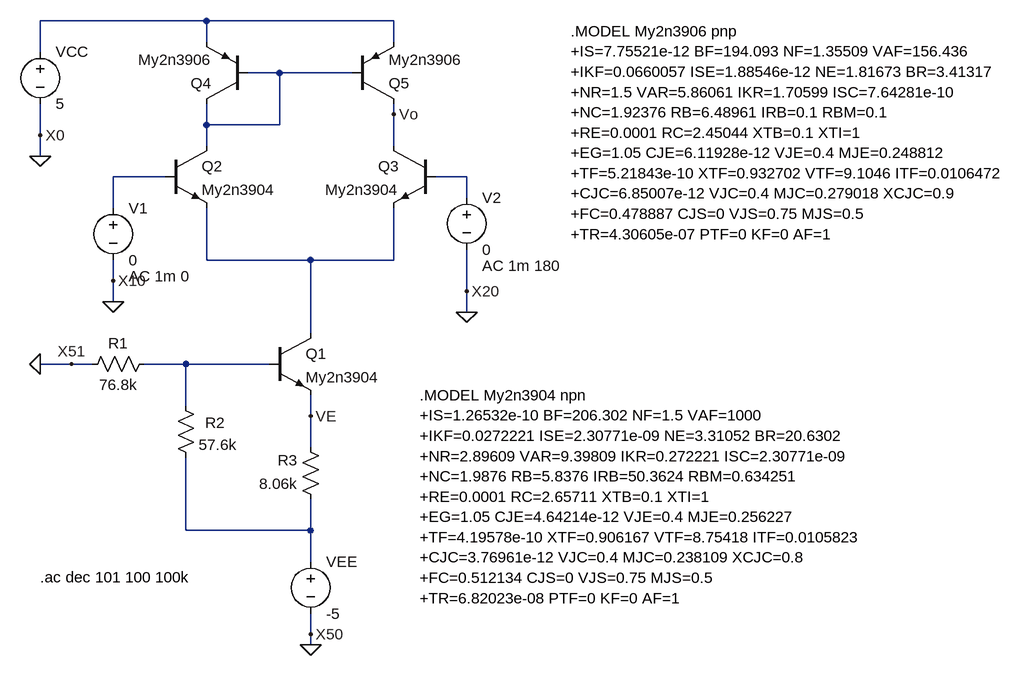
[diagram p0: schematic project3_p3.asc]
project3_p3.asc, the LTspice schematic file:
Version 4
SHEET 1 1432 700
WIRE 128 -384 -128 -384
WIRE 416 -384 128 -384
WIRE 128 -352 128 -384
WIRE 416 -352 416 -384
WIRE -128 -336 -128 -384
WIRE 240 -304 192 -304
WIRE 352 -304 240 -304
WIRE 416 -240 416 -256
WIRE 128 -224 128 -256
WIRE 240 -224 240 -304
WIRE 240 -224 128 -224
WIRE -128 -208 -128 -256
WIRE 128 -192 128 -224
WIRE 416 -192 416 -240
WIRE -128 -176 -128 -208
WIRE 64 -144 -16 -144
WIRE 528 -144 480 -144
WIRE 528 -112 528 -144
WIRE -16 -96 -16 -144
WIRE 128 -16 128 -96
WIRE 288 -16 128 -16
WIRE 416 -16 416 -96
WIRE 416 -16 288 -16
WIRE -16 16 -16 -16
WIRE 528 32 528 -32
WIRE -16 48 -16 16
WIRE 528 64 528 32
WIRE 288 96 288 -16
WIRE -80 144 -128 144
WIRE -48 144 -80 144
WIRE 96 144 32 144
WIRE 224 144 96 144
WIRE 96 208 96 144
WIRE 288 224 288 192
WIRE 288 272 288 224
WIRE 96 400 96 288
WIRE 288 400 288 352
WIRE 288 400 96 400
WIRE 288 448 288 400
WIRE 288 560 288 528
WIRE 288 576 288 560
FLAG -128 144 0
FLAG -128 -176 0
FLAG 288 576 0
FLAG 288 560 X50
FLAG -80 144 X51
FLAG -128 -208 X0
FLAG 288 224 VE
FLAG -16 48 0
FLAG -16 16 X10
FLAG 416 -240 Vo
FLAG 528 64 0
FLAG 528 32 X20
SYMBOL npn 224 96 R0
SYMATTR InstName Q1
SYMATTR Value My2n3904
SYMBOL voltage 288 432 R0
WINDOW 123 0 0 Left 0
WINDOW 39 0 0 Left 0
SYMATTR InstName VEE
SYMATTR Value -5
SYMBOL voltage -128 -352 R0
WINDOW 123 0 0 Left 0
WINDOW 39 0 0 Left 0
SYMATTR InstName VCC
SYMATTR Value 5
SYMBOL res 304 368 R180
WINDOW 0 36 76 Left 2
WINDOW 3 36 40 Left 2
SYMATTR InstName R3
SYMATTR Value 8.06k
SYMBOL res 80 192 R0
WINDOW 0 46 42 Left 2
SYMATTR InstName R2
SYMATTR Value 57.6k
SYMBOL res -64 160 R270
WINDOW 0 32 56 VTop 2
WINDOW 3 0 56 VBottom 2
SYMATTR InstName R1
SYMATTR Value 76.8k
SYMBOL voltage -16 -112 R0
WINDOW 123 24 121 Left 2
WINDOW 39 0 0 Left 0
SYMATTR Value2 AC 1m 0
SYMATTR InstName V1
SYMATTR Value 0
SYMBOL npn 64 -192 R0
SYMATTR InstName Q2
SYMATTR Value My2n3904
SYMBOL npn 480 -192 M0
SYMATTR InstName Q3
SYMATTR Value My2n3904
SYMBOL pnp 192 -256 R180
SYMATTR InstName Q4
SYMATTR Value My2n3906
SYMBOL pnp 352 -256 M180
SYMATTR InstName Q5
SYMATTR Value My2n3906
SYMBOL voltage 528 -128 R0
WINDOW 123 24 121 Left 2
WINDOW 39 0 0 Left 0
SYMATTR Value2 AC 1m 180
SYMATTR InstName V2
SYMATTR Value 0
TEXT 456 192 Left 2 !.MODEL My2n3904 npn\n+IS=1.26532e-10 BF=206.302 NF=1.5 VAF=1000\n+IKF=0.0272221 ISE=2.30771e-09 NE=3.31052 BR=20.6302\n+NR=2.89609 VAR=9.39809 IKR=0.272221 ISC=2.30771e-09\n+NC=1.9876 RB=5.8376 IRB=50.3624 RBM=0.634251\n+RE=0.0001 RC=2.65711 XTB=0.1 XTI=1\n+EG=1.05 CJE=4.64214e-12 VJE=0.4 MJE=0.256227\n+TF=4.19578e-10 XTF=0.906167 VTF=8.75418 ITF=0.0105823\n+CJC=3.76961e-12 VJC=0.4 MJC=0.238109 XCJC=0.8\n+FC=0.512134 CJS=0 VJS=0.75 MJS=0.5\n+TR=6.82023e-08 PTF=0 KF=0 AF=1
TEXT -128 472 Left 2 !.ac dec 101 100 100k
TEXT 688 -368 Left 2 !.MODEL My2n3906 pnp\n+IS=7.75521e-12 BF=194.093 NF=1.35509 VAF=156.436\n+IKF=0.0660057 ISE=1.88546e-12 NE=1.81673 BR=3.41317\n+NR=1.5 VAR=5.86061 IKR=1.70599 ISC=7.64281e-10\n+NC=1.92376 RB=6.48961 IRB=0.1 RBM=0.1\n+RE=0.0001 RC=2.45044 XTB=0.1 XTI=1\n+EG=1.05 CJE=6.11928e-12 VJE=0.4 MJE=0.248812\n+TF=5.21843e-10 XTF=0.932702 VTF=9.1046 ITF=0.0106472\n+CJC=6.85007e-12 VJC=0.4 MJC=0.279018 XCJC=0.9\n+FC=0.478887 CJS=0 VJS=0.75 MJS=0.5\n+TR=4.30605e-07 PTF=0 KF=0 AF=1

The netlist it stands for:
* project3_p3.asc
Q1 N005 N006 VE 0 My2n3904
VEE N007 0 -5
VCC N001 0 5
R3 N007 VE 8.06k
R2 N006 N007 57.6k
R1 0 N006 76.8k
V1 N003 0 0 AC 1m 0
Q2 N002 N003 N005 0 My2n3904
Q3 Vo N004 N005 0 My2n3904
Q4 N002 N002 N001 0 My2n3906
Q5 Vo N002 N001 0 My2n3906
V2 N004 0 0 AC 1m 180
.model NPN NPN
.model PNP PNP
.lib standard.bjt
.MODEL My2n3904 npn
+IS=1.26532e-10 BF=206.302 NF=1.5 VAF=1000
+IKF=0.0272221 ISE=2.30771e-09 NE=3.31052 BR=20.6302
+NR=2.89609 VAR=9.39809 IKR=0.272221 ISC=2.30771e-09
+NC=1.9876 RB=5.8376 IRB=50.3624 RBM=0.634251
+RE=0.0001 RC=2.65711 XTB=0.1 XTI=1
+EG=1.05 CJE=4.64214e-12 VJE=0.4 MJE=0.256227
+TF=4.19578e-10 XTF=0.906167 VTF=8.75418 ITF=0.0105823
+CJC=3.76961e-12 VJC=0.4 MJC=0.238109 XCJC=0.8
+FC=0.512134 CJS=0 VJS=0.75 MJS=0.5
+TR=6.82023e-08 PTF=0 KF=0 AF=1
.ac dec 101 100 100k
.MODEL My2n3906 pnp
+IS=7.75521e-12 BF=194.093 NF=1.35509 VAF=156.436
+IKF=0.0660057 ISE=1.88546e-12 NE=1.81673 BR=3.41317
+NR=1.5 VAR=5.86061 IKR=1.70599 ISC=7.64281e-10
+NC=1.92376 RB=6.48961 IRB=0.1 RBM=0.1
+RE=0.0001 RC=2.45044 XTB=0.1 XTI=1
+EG=1.05 CJE=6.11928e-12 VJE=0.4 MJE=0.248812
+TF=5.21843e-10 XTF=0.932702 VTF=9.1046 ITF=0.0106472
+CJC=6.85007e-12 VJC=0.4 MJC=0.279018 XCJC=0.9
+FC=0.478887 CJS=0 VJS=0.75 MJS=0.5
+TR=4.30605e-07 PTF=0 KF=0 AF=1
.backanno
.end